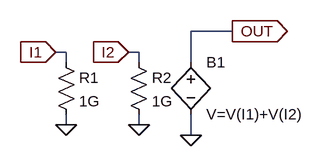
[diagram p0: schematic Z_sum2p.asc]
Z_sum2p.asc, the LTspice schematic file:
Version 4
SHEET 1 1188 680
WIRE 416 224 352 224
WIRE 160 256 144 256
WIRE 272 256 256 256
WIRE 160 272 160 256
WIRE 272 272 272 256
WIRE 352 272 352 224
WIRE 160 368 160 352
WIRE 272 368 272 352
WIRE 352 384 352 352
FLAG 144 256 I1
IOPIN 144 256 In
FLAG 416 224 OUT
IOPIN 416 224 Out
FLAG 352 384 0
FLAG 256 256 I2
IOPIN 256 256 In
FLAG 272 368 0
FLAG 160 368 0
SYMBOL bv 352 256 R0
SYMATTR InstName B1
SYMATTR Value V=V(I1)+V(I2)
SYMBOL res 144 256 R0
SYMATTR InstName R1
SYMATTR Value 1G
SYMBOL res 256 256 R0
SYMATTR InstName R2
SYMATTR Value 1G

The netlist it stands for:
* Z_sum2p.asc
B1 OUT 0 V=V(I1)+V(I2)
R1 I1 0 1G
R2 I2 0 1G
.backanno
.end